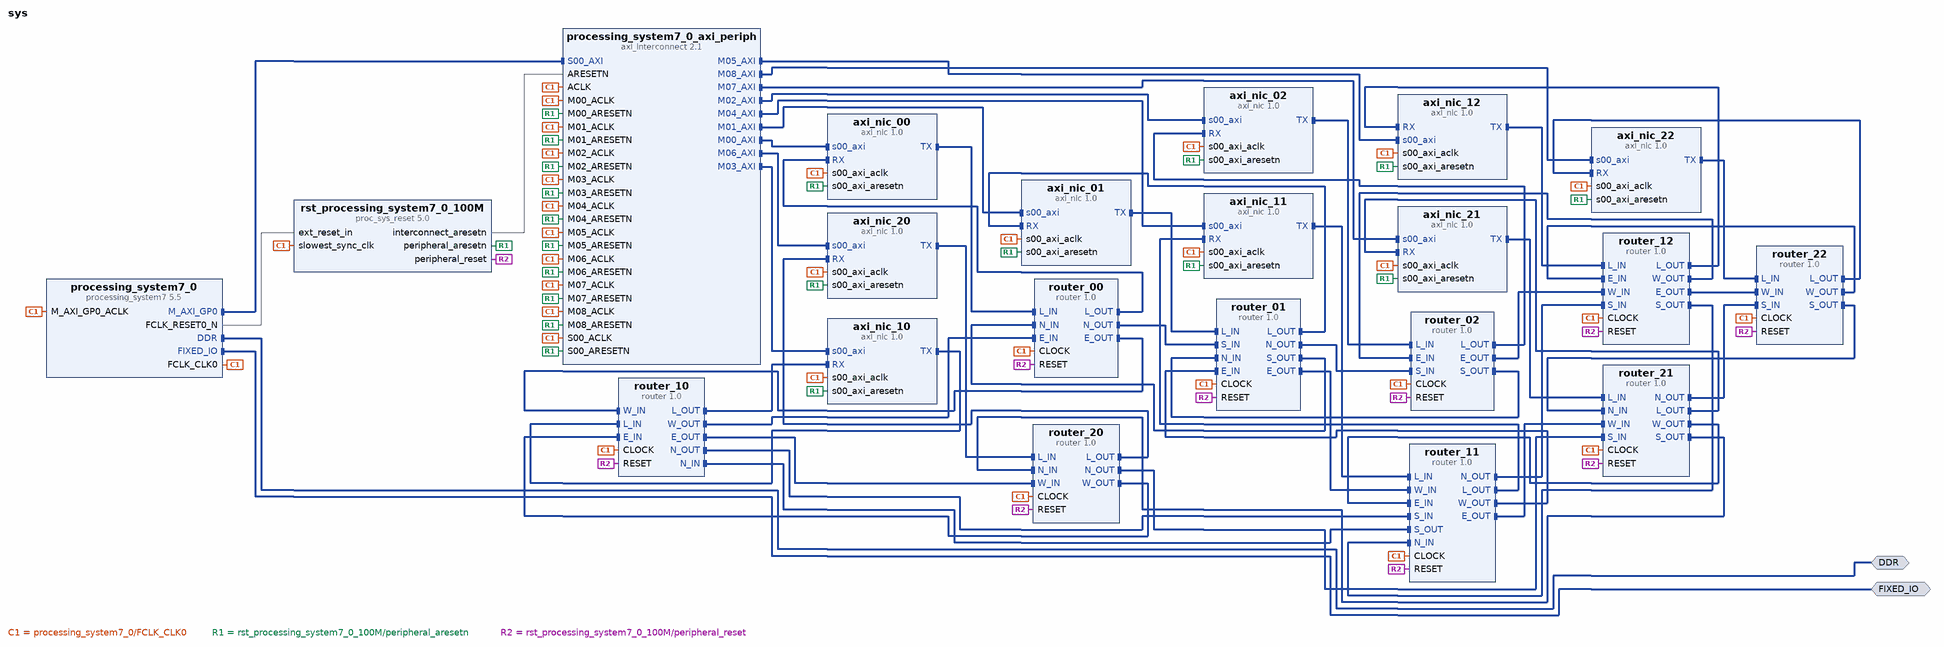
[diagram p0: block diagram of the top level]
# Vivado block design sys, xc7z020clg484-1, Vivado 2016.4
create_bd_design sys

create_bd_intf_port -mode Master -vlnv xilinx.com:interface:ddrx_rtl:1.0 DDR
create_bd_intf_port -mode Master -vlnv xilinx.com:display_processing_system7:fixedio_rtl:1.0 FIXED_IO

create_bd_cell -type ip -vlnv xilinx.com:ip:processing_system7:5.5 processing_system7_0
set_property -dict {CONFIG.preset ZedBoard} [get_bd_cells processing_system7_0]
create_bd_cell -type ip -vlnv xilinx.com:ip:axi_interconnect:2.1 processing_system7_0_axi_periph
set_property -dict {CONFIG.NUM_MI 9} [get_bd_cells processing_system7_0_axi_periph]
create_bd_cell -type ip -vlnv xilinx.com:ip:proc_sys_reset:5.0 rst_processing_system7_0_100M
create_bd_cell -type ip -vlnv user.org:user:axi_nic:1.0 axi_nic_02
set_property -dict {CONFIG.USE_1K_NOT_4K_FIFO_DEPTH false} [get_bd_cells axi_nic_02]
create_bd_cell -type ip -vlnv user.org:user:axi_nic:1.0 axi_nic_01
set_property -dict {CONFIG.USE_1K_NOT_4K_FIFO_DEPTH false} [get_bd_cells axi_nic_01]
create_bd_cell -type ip -vlnv user.org:user:axi_nic:1.0 axi_nic_10
set_property -dict {CONFIG.USE_1K_NOT_4K_FIFO_DEPTH false} [get_bd_cells axi_nic_10]
create_bd_cell -type ip -vlnv user.org:user:axi_nic:1.0 axi_nic_00
set_property -dict {CONFIG.USE_1K_NOT_4K_FIFO_DEPTH false} [get_bd_cells axi_nic_00]
create_bd_cell -type ip -vlnv user.org:user:axi_nic:1.0 axi_nic_11
set_property -dict {CONFIG.USE_1K_NOT_4K_FIFO_DEPTH false} [get_bd_cells axi_nic_11]
create_bd_cell -type ip -vlnv user.org:user:axi_nic:1.0 axi_nic_12
set_property -dict {CONFIG.USE_1K_NOT_4K_FIFO_DEPTH false} [get_bd_cells axi_nic_12]
create_bd_cell -type ip -vlnv user.org:user:axi_nic:1.0 axi_nic_20
set_property -dict {CONFIG.USE_1K_NOT_4K_FIFO_DEPTH false} [get_bd_cells axi_nic_20]
create_bd_cell -type ip -vlnv user.org:user:axi_nic:1.0 axi_nic_21
set_property -dict {CONFIG.USE_1K_NOT_4K_FIFO_DEPTH false} [get_bd_cells axi_nic_21]
create_bd_cell -type ip -vlnv user.org:user:axi_nic:1.0 axi_nic_22
set_property -dict {CONFIG.USE_1K_NOT_4K_FIFO_DEPTH false} [get_bd_cells axi_nic_22]
create_bd_cell -type ip -vlnv user.org:user:router:1.0 router_10
set_property -dict {CONFIG.ADDR_X 1 CONFIG.N_INST true CONFIG.S_INST false} [get_bd_cells router_10]
create_bd_cell -type ip -vlnv user.org:user:router:1.0 router_00
set_property -dict {CONFIG.N_INST true CONFIG.S_INST false CONFIG.W_INST false} [get_bd_cells router_00]
create_bd_cell -type ip -vlnv user.org:user:router:1.0 router_01
set_property -dict {CONFIG.ADDR_Y 1 CONFIG.W_INST false} [get_bd_cells router_01]
create_bd_cell -type ip -vlnv user.org:user:router:1.0 router_02
set_property -dict {CONFIG.ADDR_Y 2 CONFIG.N_INST false CONFIG.S_INST true CONFIG.W_INST false} [get_bd_cells router_02]
create_bd_cell -type ip -vlnv user.org:user:router:1.0 router_11
set_property -dict {CONFIG.ADDR_X 1 CONFIG.ADDR_Y 1} [get_bd_cells router_11]
create_bd_cell -type ip -vlnv user.org:user:router:1.0 router_12
set_property -dict {CONFIG.ADDR_X 1 CONFIG.ADDR_Y 2 CONFIG.N_INST false CONFIG.S_INST true} [get_bd_cells router_12]
create_bd_cell -type ip -vlnv user.org:user:router:1.0 router_20
set_property -dict {CONFIG.ADDR_X 2 CONFIG.N_INST true CONFIG.S_INST false CONFIG.E_INST false} [get_bd_cells router_20]
create_bd_cell -type ip -vlnv user.org:user:router:1.0 router_21
set_property -dict {CONFIG.ADDR_X 2 CONFIG.ADDR_Y 1 CONFIG.E_INST false} [get_bd_cells router_21]
create_bd_cell -type ip -vlnv user.org:user:router:1.0 router_22
set_property -dict [list \
  CONFIG.ADDR_X 2 \
  CONFIG.ADDR_Y 2 \
  CONFIG.N_INST false \
  CONFIG.S_INST true \
  CONFIG.E_INST false \
] [get_bd_cells router_22]

# ---- connections ----

connect_bd_intf_net [get_bd_intf_pins processing_system7_0/M_AXI_GP0] [get_bd_intf_pins processing_system7_0_axi_periph/S00_AXI]
connect_bd_intf_net [get_bd_intf_pins processing_system7_0_axi_periph/M00_AXI] [get_bd_intf_pins axi_nic_00/s00_axi]
connect_bd_intf_net [get_bd_intf_pins processing_system7_0_axi_periph/M01_AXI] [get_bd_intf_pins axi_nic_01/s00_axi]
connect_bd_intf_net [get_bd_intf_pins processing_system7_0_axi_periph/M02_AXI] [get_bd_intf_pins axi_nic_02/s00_axi]
connect_bd_intf_net [get_bd_intf_pins processing_system7_0_axi_periph/M03_AXI] [get_bd_intf_pins axi_nic_10/s00_axi]
connect_bd_intf_net [get_bd_intf_pins processing_system7_0_axi_periph/M04_AXI] [get_bd_intf_pins axi_nic_11/s00_axi]
connect_bd_intf_net [get_bd_intf_pins processing_system7_0_axi_periph/M05_AXI] [get_bd_intf_pins axi_nic_12/s00_axi]
connect_bd_intf_net [get_bd_intf_pins processing_system7_0_axi_periph/M06_AXI] [get_bd_intf_pins axi_nic_20/s00_axi]
connect_bd_intf_net [get_bd_intf_pins processing_system7_0_axi_periph/M07_AXI] [get_bd_intf_pins axi_nic_21/s00_axi]
connect_bd_intf_net [get_bd_intf_pins processing_system7_0_axi_periph/M08_AXI] [get_bd_intf_pins axi_nic_22/s00_axi]
connect_bd_intf_net [get_bd_intf_pins router_00/E_OUT] [get_bd_intf_pins router_10/W_IN]
connect_bd_intf_net [get_bd_intf_pins router_10/E_OUT] [get_bd_intf_pins router_20/W_IN]
connect_bd_intf_net [get_bd_intf_pins router_11/E_OUT] [get_bd_intf_pins router_21/W_IN]
connect_bd_intf_net [get_bd_intf_pins router_12/E_OUT] [get_bd_intf_pins router_22/W_IN]
connect_bd_intf_net [get_bd_intf_pins router_02/E_OUT] [get_bd_intf_pins router_12/W_IN]
connect_bd_intf_net [get_bd_intf_pins router_01/E_OUT] [get_bd_intf_pins router_11/W_IN]
connect_bd_intf_net [get_bd_intf_pins router_01/E_IN] [get_bd_intf_pins router_11/W_OUT]
connect_bd_intf_net [get_bd_intf_pins router_12/W_OUT] [get_bd_intf_pins router_02/E_IN]
connect_bd_intf_net [get_bd_intf_pins router_22/W_OUT] [get_bd_intf_pins router_12/E_IN]
connect_bd_intf_net [get_bd_intf_pins router_21/W_OUT] [get_bd_intf_pins router_11/E_IN]
connect_bd_intf_net [get_bd_intf_pins router_20/W_OUT] [get_bd_intf_pins router_10/E_IN]
connect_bd_intf_net [get_bd_intf_pins router_10/W_OUT] [get_bd_intf_pins router_00/E_IN]
connect_bd_intf_net [get_bd_intf_pins axi_nic_00/TX] [get_bd_intf_pins router_00/L_IN]
connect_bd_intf_net [get_bd_intf_pins axi_nic_00/RX] [get_bd_intf_pins router_00/L_OUT]
connect_bd_intf_net [get_bd_intf_pins axi_nic_01/TX] [get_bd_intf_pins router_01/L_IN]
connect_bd_intf_net [get_bd_intf_pins axi_nic_01/RX] [get_bd_intf_pins router_01/L_OUT]
connect_bd_intf_net [get_bd_intf_pins axi_nic_02/TX] [get_bd_intf_pins router_02/L_IN]
connect_bd_intf_net [get_bd_intf_pins axi_nic_02/RX] [get_bd_intf_pins router_02/L_OUT]
connect_bd_intf_net [get_bd_intf_pins axi_nic_10/TX] [get_bd_intf_pins router_10/L_IN]
connect_bd_intf_net [get_bd_intf_pins axi_nic_10/RX] [get_bd_intf_pins router_10/L_OUT]
connect_bd_intf_net [get_bd_intf_pins axi_nic_11/TX] [get_bd_intf_pins router_11/L_IN]
connect_bd_intf_net [get_bd_intf_pins axi_nic_11/RX] [get_bd_intf_pins router_11/L_OUT]
connect_bd_intf_net [get_bd_intf_pins axi_nic_12/TX] [get_bd_intf_pins router_12/L_IN]
connect_bd_intf_net [get_bd_intf_pins axi_nic_12/RX] [get_bd_intf_pins router_12/L_OUT]
connect_bd_intf_net [get_bd_intf_pins axi_nic_22/TX] [get_bd_intf_pins router_22/L_IN]
connect_bd_intf_net [get_bd_intf_pins axi_nic_22/RX] [get_bd_intf_pins router_22/L_OUT]
connect_bd_intf_net [get_bd_intf_pins axi_nic_21/TX] [get_bd_intf_pins router_21/L_IN]
connect_bd_intf_net [get_bd_intf_pins axi_nic_21/RX] [get_bd_intf_pins router_21/L_OUT]
connect_bd_intf_net [get_bd_intf_pins axi_nic_20/TX] [get_bd_intf_pins router_20/L_IN]
connect_bd_intf_net [get_bd_intf_pins axi_nic_20/RX] [get_bd_intf_pins router_20/L_OUT]
connect_bd_intf_net [get_bd_intf_pins router_02/S_OUT] [get_bd_intf_pins router_01/N_IN]
connect_bd_intf_net [get_bd_intf_pins router_01/N_OUT] [get_bd_intf_pins router_02/S_IN]
connect_bd_intf_net [get_bd_intf_pins router_01/S_OUT] [get_bd_intf_pins router_00/N_IN]
connect_bd_intf_net [get_bd_intf_pins router_00/N_OUT] [get_bd_intf_pins router_01/S_IN]
connect_bd_intf_net [get_bd_intf_pins router_10/N_OUT] [get_bd_intf_pins router_11/S_IN]
connect_bd_intf_net [get_bd_intf_pins router_10/N_IN] [get_bd_intf_pins router_11/S_OUT]
connect_bd_intf_net [get_bd_intf_pins router_11/N_OUT] [get_bd_intf_pins router_12/S_IN]
connect_bd_intf_net [get_bd_intf_pins router_12/S_OUT] [get_bd_intf_pins router_11/N_IN]
connect_bd_intf_net [get_bd_intf_pins router_22/S_OUT] [get_bd_intf_pins router_21/N_IN]
connect_bd_intf_net [get_bd_intf_pins router_21/N_OUT] [get_bd_intf_pins router_22/S_IN]
connect_bd_intf_net [get_bd_intf_pins router_21/S_OUT] [get_bd_intf_pins router_20/N_IN]
connect_bd_intf_net [get_bd_intf_pins router_20/N_OUT] [get_bd_intf_pins router_21/S_IN]
connect_bd_intf_net [get_bd_intf_ports DDR] [get_bd_intf_pins processing_system7_0/DDR]
connect_bd_intf_net [get_bd_intf_ports FIXED_IO] [get_bd_intf_pins processing_system7_0/FIXED_IO]
connect_bd_net [get_bd_pins processing_system7_0/FCLK_CLK0] \
  [get_bd_pins processing_system7_0/M_AXI_GP0_ACLK] [get_bd_pins rst_processing_system7_0_100M/slowest_sync_clk] \
  [get_bd_pins processing_system7_0_axi_periph/ACLK] [get_bd_pins processing_system7_0_axi_periph/S00_ACLK] \
  [get_bd_pins processing_system7_0_axi_periph/M00_ACLK] [get_bd_pins processing_system7_0_axi_periph/M01_ACLK] \
  [get_bd_pins processing_system7_0_axi_periph/M02_ACLK] [get_bd_pins processing_system7_0_axi_periph/M03_ACLK] \
  [get_bd_pins processing_system7_0_axi_periph/M04_ACLK] [get_bd_pins processing_system7_0_axi_periph/M05_ACLK] \
  [get_bd_pins processing_system7_0_axi_periph/M06_ACLK] [get_bd_pins processing_system7_0_axi_periph/M07_ACLK] \
  [get_bd_pins processing_system7_0_axi_periph/M08_ACLK] [get_bd_pins axi_nic_02/s00_axi_aclk] \
  [get_bd_pins axi_nic_01/s00_axi_aclk] [get_bd_pins axi_nic_10/s00_axi_aclk] [get_bd_pins axi_nic_00/s00_axi_aclk] \
  [get_bd_pins axi_nic_11/s00_axi_aclk] [get_bd_pins axi_nic_12/s00_axi_aclk] [get_bd_pins axi_nic_20/s00_axi_aclk] \
  [get_bd_pins axi_nic_21/s00_axi_aclk] [get_bd_pins axi_nic_22/s00_axi_aclk] [get_bd_pins router_10/CLOCK] \
  [get_bd_pins router_00/CLOCK] [get_bd_pins router_01/CLOCK] [get_bd_pins router_02/CLOCK] [get_bd_pins router_11/CLOCK] \
  [get_bd_pins router_12/CLOCK] [get_bd_pins router_20/CLOCK] [get_bd_pins router_21/CLOCK] [get_bd_pins router_22/CLOCK]
connect_bd_net [get_bd_pins processing_system7_0/FCLK_RESET0_N] [get_bd_pins rst_processing_system7_0_100M/ext_reset_in]
connect_bd_net [get_bd_pins rst_processing_system7_0_100M/peripheral_aresetn] \
  [get_bd_pins processing_system7_0_axi_periph/S00_ARESETN] [get_bd_pins processing_system7_0_axi_periph/M00_ARESETN] \
  [get_bd_pins processing_system7_0_axi_periph/M01_ARESETN] [get_bd_pins processing_system7_0_axi_periph/M02_ARESETN] \
  [get_bd_pins processing_system7_0_axi_periph/M03_ARESETN] [get_bd_pins processing_system7_0_axi_periph/M04_ARESETN] \
  [get_bd_pins processing_system7_0_axi_periph/M05_ARESETN] [get_bd_pins processing_system7_0_axi_periph/M06_ARESETN] \
  [get_bd_pins processing_system7_0_axi_periph/M07_ARESETN] [get_bd_pins processing_system7_0_axi_periph/M08_ARESETN] \
  [get_bd_pins axi_nic_02/s00_axi_aresetn] [get_bd_pins axi_nic_01/s00_axi_aresetn] [get_bd_pins axi_nic_10/s00_axi_aresetn] \
  [get_bd_pins axi_nic_00/s00_axi_aresetn] [get_bd_pins axi_nic_11/s00_axi_aresetn] [get_bd_pins axi_nic_12/s00_axi_aresetn] \
  [get_bd_pins axi_nic_20/s00_axi_aresetn] [get_bd_pins axi_nic_21/s00_axi_aresetn] [get_bd_pins axi_nic_22/s00_axi_aresetn]
connect_bd_net [get_bd_pins rst_processing_system7_0_100M/interconnect_aresetn] [get_bd_pins processing_system7_0_axi_periph/ARESETN]
connect_bd_net [get_bd_pins rst_processing_system7_0_100M/peripheral_reset] \
  [get_bd_pins router_10/RESET] [get_bd_pins router_00/RESET] [get_bd_pins router_01/RESET] [get_bd_pins router_02/RESET] \
  [get_bd_pins router_11/RESET] [get_bd_pins router_12/RESET] [get_bd_pins router_20/RESET] [get_bd_pins router_21/RESET] \
  [get_bd_pins router_22/RESET]

# ---- address map ----
assign_bd_address -offset 0x43C00000 -range 64K -target_address_space [get_bd_addr_spaces processing_system7_0/Data] [get_bd_addr_segs axi_nic_00/s00_axi/reg0]
assign_bd_address -offset 0x43C10000 -range 64K -target_address_space [get_bd_addr_spaces processing_system7_0/Data] [get_bd_addr_segs axi_nic_01/s00_axi/reg0]
assign_bd_address -offset 0x43C20000 -range 64K -target_address_space [get_bd_addr_spaces processing_system7_0/Data] [get_bd_addr_segs axi_nic_02/s00_axi/reg0]
assign_bd_address -offset 0x43C30000 -range 64K -target_address_space [get_bd_addr_spaces processing_system7_0/Data] [get_bd_addr_segs axi_nic_10/s00_axi/reg0]
assign_bd_address -offset 0x43C40000 -range 64K -target_address_space [get_bd_addr_spaces processing_system7_0/Data] [get_bd_addr_segs axi_nic_11/s00_axi/reg0]
assign_bd_address -offset 0x43C50000 -range 64K -target_address_space [get_bd_addr_spaces processing_system7_0/Data] [get_bd_addr_segs axi_nic_12/s00_axi/reg0]
assign_bd_address -offset 0x43C60000 -range 64K -target_address_space [get_bd_addr_spaces processing_system7_0/Data] [get_bd_addr_segs axi_nic_20/s00_axi/reg0]
assign_bd_address -offset 0x43C70000 -range 64K -target_address_space [get_bd_addr_spaces processing_system7_0/Data] [get_bd_addr_segs axi_nic_21/s00_axi/reg0]
assign_bd_address -offset 0x43C80000 -range 64K -target_address_space [get_bd_addr_spaces processing_system7_0/Data] [get_bd_addr_segs axi_nic_22/s00_axi/reg0]

validate_bd_design
save_bd_design
